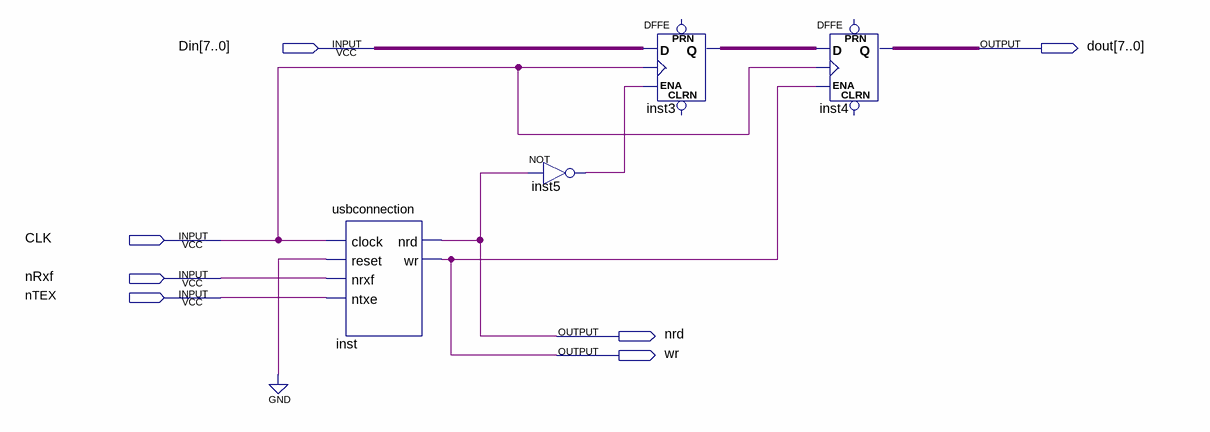
[diagram p0: schematic sheet]
// Quartus schematic usbconnection.bdf as structural Verilog: 4 symbols, 7 pins
module usbconnection (
  input  [7:0] Din,
  input  CLK,
  input  nRxf,
  input  nTEX,
  output [7:0] dout,
  output nrd,
  output wr
);

  wire inst5_out;
  wire [7:0] inst3_q;

  usbconnection inst (.clock(CLK), .reset(1'b0), .nrxf(nRxf), .ntxe(nTEX), .nrd(nrd), .wr(wr));
  not inst5 (inst5_out, nrd);
  DFFE inst3[7:0] (.D(Din), .CLK(CLK), .ENA(inst5_out), .Q(inst3_q));  // open: PRN, CLRN
  DFFE inst4[7:0] (.D(inst3_q), .CLK(CLK), .ENA(wr), .Q(dout));  // open: PRN, CLRN
endmodule
